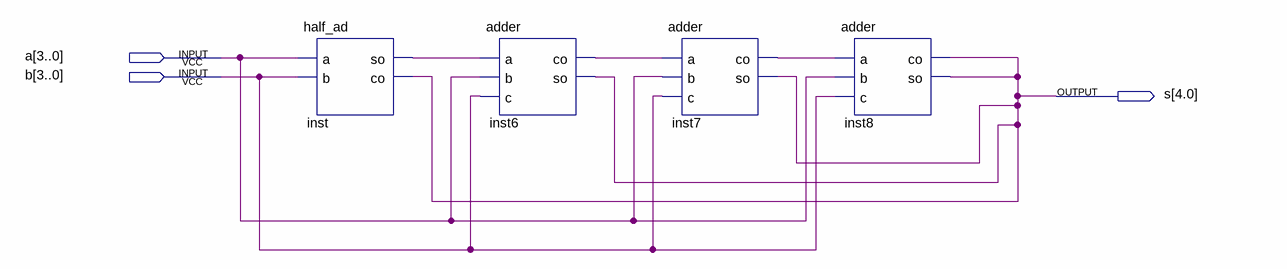
[diagram p0: schematic sheet]
// Quartus schematic adder_4.bdf as structural Verilog: 4 symbols, 3 pins
module adder_4 (
  input  [3:0] a,
  input  [3:0] b,
  output \s[4.0] 
);

  wire inst6_co, inst7_co, inst_so, undriven, undriven_2;

  half_ad inst (.a(undriven), .b(undriven_2), .so(inst_so), .co(\s[4.0] ));
  adder inst6 (.a(inst_so), .b(undriven), .c(undriven_2), .co(inst6_co), .so(\s[4.0] ));
  adder inst7 (.a(inst6_co), .b(undriven), .c(undriven_2), .co(inst7_co), .so(\s[4.0] ));
  adder inst8 (.a(inst7_co), .b(undriven), .c(undriven_2), .co(\s[4.0] ), .so(\s[4.0] ));
endmodule
